# Altium project Telemetry_Pi_Board.PrjPcb
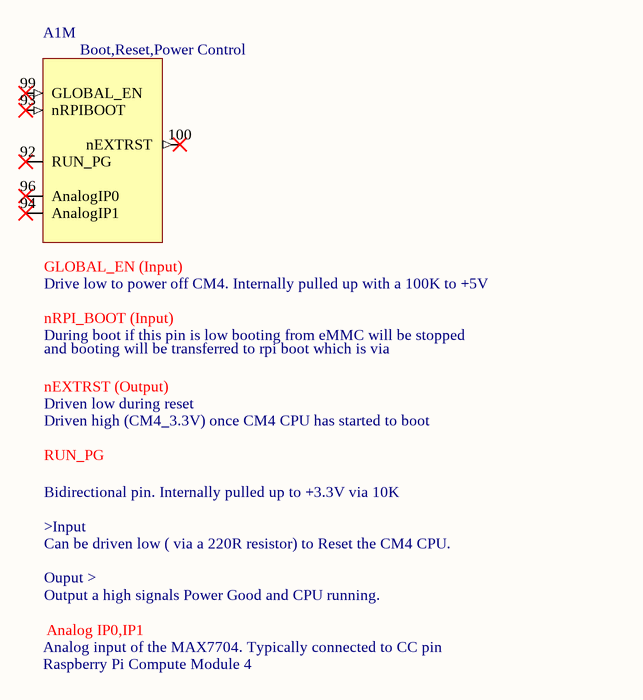
[diagram p0: Pi_Boot_Control.SchDoc]
10 sheets, 106 parts. Net scope: global (net labels, ports and power ports of the same name join across sheets).
Board file: PCB1.PcbDoc
Sheets:
  Pi_Boot_Control.SchDoc
  Telemetry_Pi_Board.SchDoc
  Power.SchDoc
  Pi_Power.SchDoc
  Pi_Cellular.SchDoc
  Ethernet.SchDoc
  Other_Pi.SchDoc
  Other_Pi_2.SchDoc
  GPIO_CAN.SchDoc
  SD_Card.SchDoc

## Sheet Pi_Boot_Control.SchDoc
size A; SheetNumber: 1; SheetTotal: 10

### Parts
A1  Raspberry Pi Compute Module 4  [CM4-F40C-100DS-0.4v_1.5mm_0mm]  (part M of 21)  (no BOM)

### Nets

Not connected (* = marked no-connect by the designer): A1 92(RUN_PG)* 93(nRPIBOOT)* 94(AnalogIP1)* 96(AnalogIP0)* 99(GLOBAL_EN)* 100(nEXTRST)*

### Notes on the sheet
- (in symbol CM4, part M) Boot,Reset,Power Control; GLOBAL_EN (Input); Drive low to power off CM4. Internally pulled up with a 100K to +5V; nRPI_BOOT (Input); During boot if this pin is low booting from eMMC will be stopped; and booting will be transferred to rpi boot which is via; nEXTRST (Output); Driven low during reset; Driven high (CM4_3.3V) once CM4 CPU has started to boot; Bidirectional pin. Internally pulled up to +3.3V via 10K / >Input / Can be driven low ( via a 220R resistor) to Reset the CM4 CPU. / Ouput > / Output a high signals Power Good and CPU running.; Analog IP0,IP1; Analog input of the MAX7704. Typically connected to CC pin

### Library data of the parts
A1 = CM4: Raspberry Pi Compute Module 4 by Amornthep Phunsin; MPN: -

## Sheet Telemetry_Pi_Board.SchDoc
size 279 x 215 mm; SheetNumber: 2; SheetTotal: 10
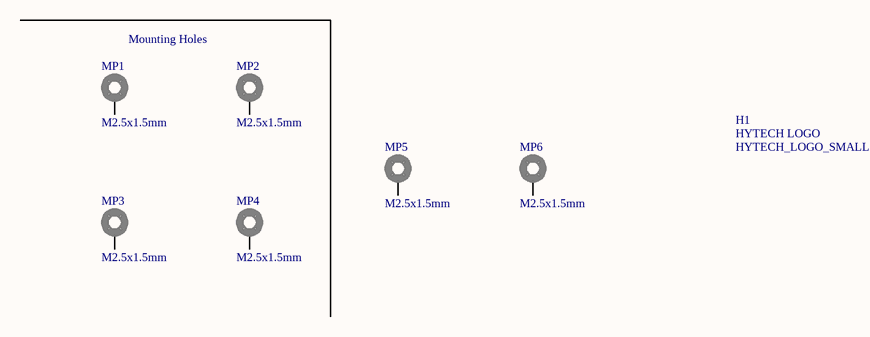
[diagram p1: Telemetry_Pi_Board.SchDoc]

### Parts
H1  HYTECH_LOGO_SMALL  [LOGO-HYTECH-SMALL]
MP1  M2.5x1.5mm  [9774015151]
MP2  M2.5x1.5mm  [9774015151]
MP3  M2.5x1.5mm  [9774015151]
MP4  M2.5x1.5mm  [9774015151]
MP5  M2.5x1.5mm  [9774015151]
MP6  M2.5x1.5mm  [9774015151]

### Nets

Not connected (* = marked no-connect by the designer): MP1 1; MP2 1; MP3 1; MP4 1; MP5 1; MP6 1

### Notes on the sheet
- Mounting Holes
- (in symbol HYTECH_LOGO_SMALL) HYTECH LOGO

### Library data of the parts
MP1-MP6 = 9774015151: WA-SMSI SMT Steel Spacer, M2.5 Thread Internal, OD 5.1mm, M2.5x1.5mm; Manufacturer: Wurth Elektronik; Inner Diameter: 3.5mm; Surface: Tin; ComponentLink1Description: Manufacturer; ComponentLink1URL: http://www.we-online.de; ComponentLink2Description: Datasheet; ComponentLink2URL: https://www.we-online.com/catalog/datasheet/9774015151.pdf; Mounting Technology: SMT; Packaging: Bulk; Length: 1.5mm; Inner Thread Length: -; Operating Temperature: -55 to +150degC; Outer Diameter: 5.1mm; Published Date: April 2020; Material: Steel; Thread: M2.5; MPN: 9774015151; MFR: Wurth Elektronik
H1 = HYTECH_LOGO_SMALL: MPN: -; MFR: -

## Sheet Power.SchDoc
size 279 x 215 mm; SheetNumber: 3; SheetTotal: 10
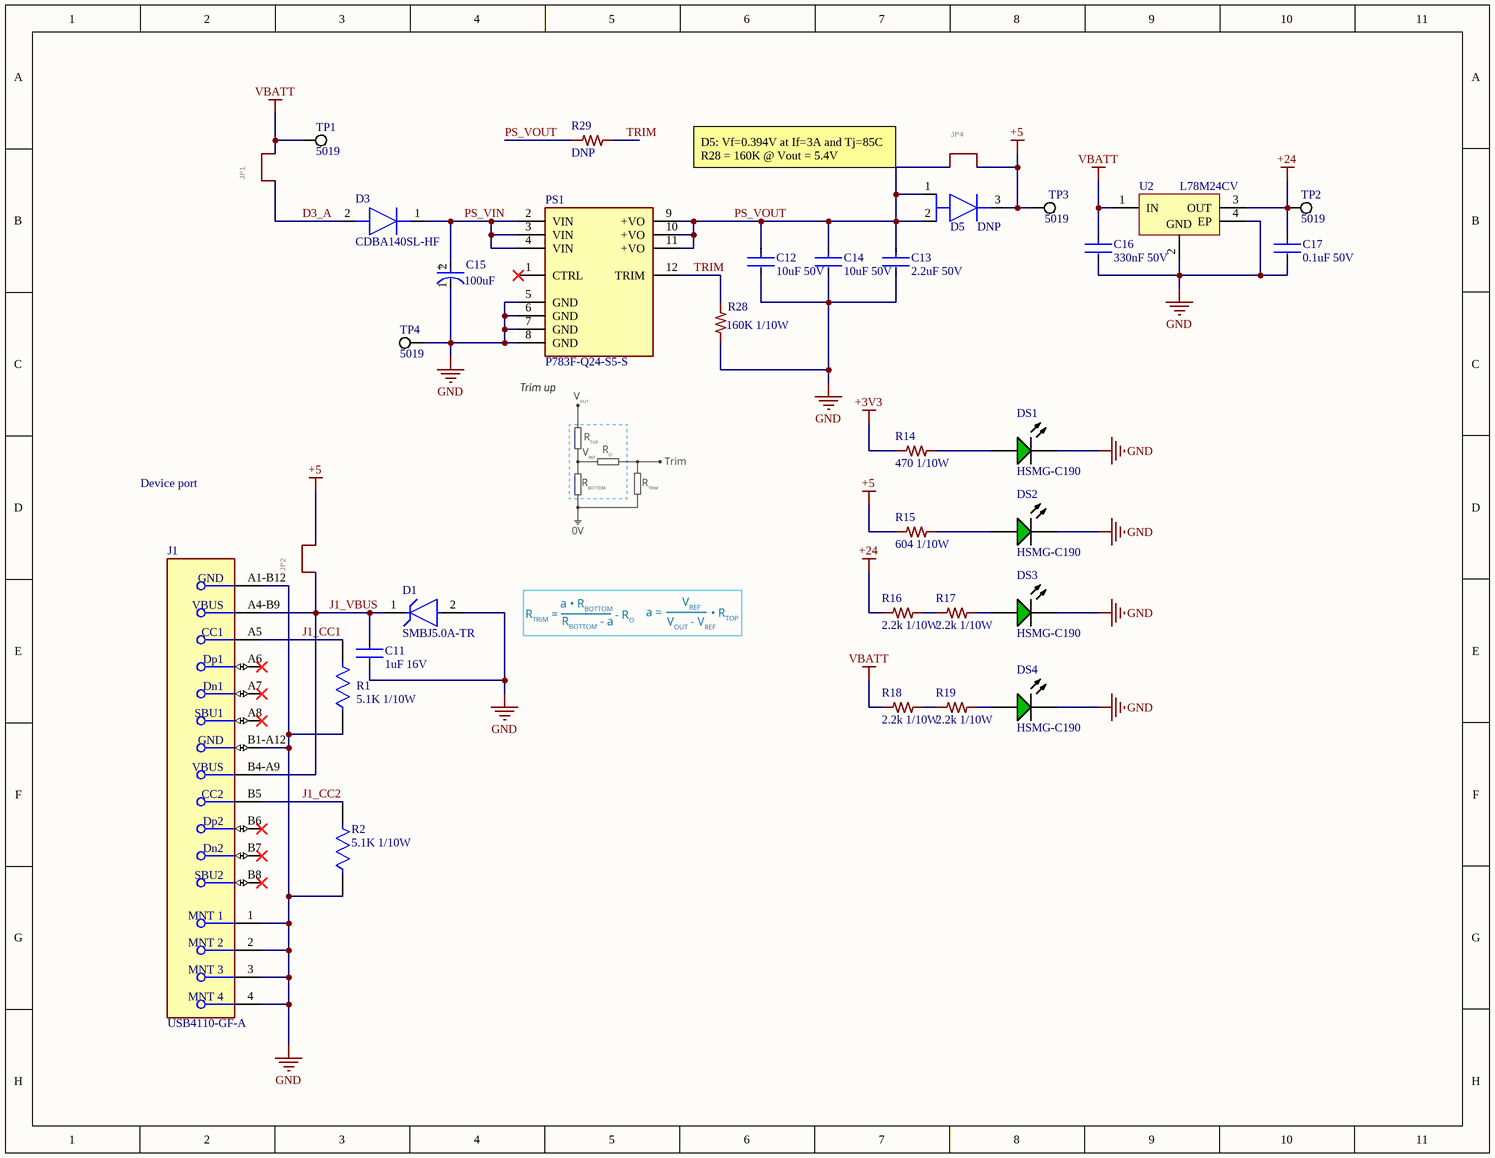
[diagram p2: Power.SchDoc]

### Parts
C11  1uF 16V  [CAPACITOR_0603]
C12  10uF 50V  [FP-GRM21B-0_2-e0_2_0_7-IPC_A]
C13  2.2uF 50V  [CAPACITOR_0603]
C14  10uF 50V  [FP-GRM21B-0_2-e0_2_0_7-IPC_A]
C15  Capacitance: 100uF  [FP-UWT1H101MNL1GS-MFG]  (hidden comment: UWT1H101MNL1GS)
C16  330nF 50V  [CAPACITOR_0603]
C17  0.1uF 50V  [CAPACITOR_0603]
D1  SMBJ5.0A-TR  [FP-SMB-MFG]
D3  CDBA140SL-HF  [DIOM5225X250N]
D5  PMEG045T050EPDZ  [PMEG060V100EPDZ]  (value not drawn)
DS1  HSMG-C190  [AVAG-HSMX-C190_V]
DS2  HSMG-C190  [AVAG-HSMX-C190_V]
DS3  HSMG-C190  [AVAG-HSMX-C190_V]
DS4  HSMG-C190  [AVAG-HSMX-C190_V]
J1  USB4110-GF-A  [FP-USB4110-GF-A-MFG]
JP1  TSM-102-01-L-SV  [FP-TSM-102-01-L-SV-P-TR-MFG]  (value not drawn)
JP2  TSM-102-01-L-SV  [FP-TSM-102-01-L-SV-P-TR-MFG]  (value not drawn)
JP4  CRCW12100000Z0EA  [FP-RMCF1210-IPC_B]  (value not drawn)
PS1  P783F-Q24-S5-S  [CONV_P783F-Q24-S5-S]
R1  5.1K 1/10W  [0603R]
R2  5.1K 1/10W  [0603R]
R14  470 1/10W  [0603R]
R15  604 1/10W  [0603R]
R16  2.2k 1/10W  [0603R]
R17  2.2k 1/10W  [0603R]
R18  2.2k 1/10W  [0603R]
R19  2.2k 1/10W  [0603R]
R28  160K 1/10W  [0603R]
R29  (no value)  [0603R]
TP1  5019  [KSTN-5019_V]
TP2  5019  [KSTN-5019_V]
TP3  5019  [KSTN-5019_V]
TP4  5019  [KSTN-5019_V]
U2  L78M24CV  [TO-220]

### Nets
+3V3: R14.1
+5: D5.3(K) JP2.2 JP4.2 R15.1 TP3.1
+24: C17.2 R16.1 TP2.1 U2.3(OUT)
GND: C11.1 C12.2 C13.2 C14.2 C15.1(C) C16.1 C17.1 D1.2(A) DS1.2(K) DS2.2(K) DS3.2(K) DS4.2(K) J1.1(MNT_1) J1.2(MNT_2) J1.3(MNT_3) J1.4(MNT_4) J1.A1-B12(GND) J1.B1-A12(GND) PS1.5(GND) PS1.6(GND) PS1.7(GND) PS1.8(GND) R1.1 R2.1 R28.1 TP4.1 U2.2(GND) U2.4(EP)
VBATT: C16.2 JP1.2 R18.1 TP1.1 U2.1(IN)
D3_A: D3.2(A) JP1.1
J1_CC1: J1.A5(CC1) R1.2
J1_CC2: J1.B5(CC2) R2.2
J1_VBUS: C11.2 D1.1(K) J1.A4-B9(VBUS) J1.B4-A9(VBUS) JP2.1
PS_VIN: C15.2(A) D3.1(K) PS1.2(VIN) PS1.3(VIN) PS1.4(VIN)
PS_VOUT: C12.1 C13.1 C14.1 D5.1(A) D5.2(A) JP4.1 PS1.9(+VO) PS1.10(+VO) PS1.11(+VO) R29.2
TRIM: PS1.12(TRIM) R28.2 R29.1
NetDS1_1: DS1.1(A) R14.2
NetDS2_1: DS2.1(A) R15.2
NetDS3_1: DS3.1(A) R17.2
NetDS4_1: DS4.1(A) R19.2
NetR16_2: R16.2 R17.1
NetR18_2: R18.2 R19.1

Not connected (* = marked no-connect by the designer): J1 A6(Dp1)* A7(Dn1)* A8(SBU1)* B6(Dp2)* B7(Dn2)* B8(SBU2)*; PS1 1(CTRL)*

### Notes on the sheet
- D5: Vf=0.394V at If=3A and Tj=85C
  R28 = 160K @ Vout = 5.4V
- Device port
- (in symbol CMP-2000-07373-2) +

### Library data of the parts
C11 = CL10A105KO8NNNC: CAP CER 1UF 16V X5R 0603; MFR: Samsung Electro-Mechanics; MPN: CL10A105KO8NNNC
C12 C14 = CMP-06035-004402-1: Chip Multilayer Ceramic Capacitors for General Purpose, 0805, 10uF, X5R, 15%, 10%, 50V; MPN: GRM21BR61H106KE43L; MFR: Murata Electronics; Voltage Rating (DC): 50V; Dielectric: X5R; Tolerance: 10%; Capacitance: 10uF; Thickness: 1.25mm; Length: 2mm; Width: 1.25mm
C13 = GRT188R61H225KE13D: CAP CER 2.2UF 50V X5R 0603; MFR: Murata Electronics; Tolerance: 10%; Case Code (Metric): 1608; Voltage Rating: 50V; Thickness: 0.035inch; Min Operating Temperature: -55°C; Length: 0.063inch; Case/Package: 0603; Mount: Surface Mount; Max Operating Temperature: 85°C; Capacitance: 2.2uF; Dielectric: X5R; Voltage Rating (DC): 50V; Ratings: AEC-Q200; Width: 0.031inch; Case Code (Imperial): 0603; Packaging: Tape and Reel; MPN: GRT188R61H225KE13D
C15 = CMP-2000-07373-2: CAP ALUM 100UF 20% 50V SMD; MFR: Nichicon; Leakage Current: 3uA; Ripple Current: 140mA; Life (Hours): 1000Hour; Dissipation Factor: 0.14%; Dielectric Material: Aluminium; Termination: SMD/SMT; Tolerance: 20%; Package Quantity: 500; Height: 10mm; REACH SVHC: No SVHC; Case/Package: Radial; Series: WT; Diameter: 8mm; Voltage Rating: 50V; Construction: Cylindrical; Length: 10mm; Min Operating Temperature: -55°C; Max Operating Temperature: 105°C; Voltage Rating (DC): 50V; Packaging: Tape and Reel; Voltage: 50V; Mount: Surface Mount; Ripple Current (AC): 140mA; Radiation Hardening: No; Number of Pins: 2; Lead Free: Lead Free; Height - Seated (Max): 0.413inch; RoHS Compliant: Yes; MPN: UWT1H101MNL1GS
C16 = C1608X7R1H334K080AC: CAP CER 0.33UF 50V X7R 0603; MFR: TDK Corporation; Tolerance: 10%; Dielectric Material: Ceramic; Capacitance: 330nF; Case Code (Imperial): 0603; Case Code (Metric): 1608; Dielectric: X7R; Length: 1.6mm; Construction: Flat; Resistor Type: Ceramic; Mount: Surface Mount; Voltage Rating: 50V; Packaging: Tape and Reel; Series: C; Case/Package: 0603; Lead Free: Lead Free; Voltage: 50V; REACH SVHC: No SVHC; Height: 0.8mm; Weight: 7.1E-05oz; Termination: SMD/SMT; Max Operating Temperature: 125°C; RoHS Compliant: Yes; Min Operating Temperature: -55°C; Depth: 0.8mm; Package Quantity: 1; Thickness: 0.037inch; Voltage Rating (DC): 50V; Width: 0.031inch; MPN: C1608X7R1H334K080AC
C17 = CL10B104KB8NNWC: CAP CER 0.1UF 50V X7R 0603; MFR: Samsung Electro-Mechanics; MPN: CL10B104KB8NNWC
D1 = SMBJ5.0A-TR: TVS DIODE 5V 13.4V SMB; MFR: STMicroelectronics; Number Of Channels: 1; Peak Pulse Power: 600W; Clamping Voltage: 14.4V; Standoff Height: 0.05mm; Peak Pulse Current: 275A; Max Junction Temp: +150°C; Direction: Unidirectional; Device Class L3: unset; Mouser Description: SMBJ Series 600 W 5 V Uni Directional SMT TVS Diode - DO-214AA; Lead Free: Yes; ComponentLink2URL: https://www.st.com/resource/en/datasheet/smbj.pdf; Package: SMB; Reverse Standoff Voltage: 5V; Device Class L1: Circuit Protection; RoHS: TRUE; Temperature Range Low: -55°C; Category: Diode; MPN: SMBJ5.0A-TR; Digikey Description: TVS DIODE 5V 13.4V SMB; Height: 2.65mm; Temperature Range High: +150°C; Octopart: https://octopart.com/smbj5.0a-tr-stmicroelectronics-347079; Device Class L2: TVS Diodes; ComponentLink2Description: Datasheet; Temperature: -55°C to +150°C
D3 = CDBA140SL-HF: DIODE SCHOTTKY 40V 1.4A DO214AC; Manufacturer_Name: Comchip Technology; Datasheet Link: http://www.mouser.com/ds/2/80/CDBA140SL-HF RevC729463-766397.pdf; Height: 2.5mm; MPN: CDBA140SL-HF; Mouser Part Number: 750-CDBA140SL-HF; Mouser Price/Stock: https://www.mouser.co.uk/ProductDetail/Comchip-Technology/CDBA140SL-HF?qs=2qJf6qQ4IOIs6CdtgpGzGA%3D%3D; Arrow Part Number: CDBA140SL-HF; MFR: Comchip Technology
D5 = PMEG045T050EPDZ: DIODE SCHOTTKY 45V 5A CFP15; MFR: Nexperia USA Inc.; DNP: DNP; MPN: PMEG045T050EPDZ
DS1-DS4 = HSMG-C190: Chip LED, Green, 2.2 V, -40 to 85 degC, 2-Pin SMD, RoHS, Tape and Reel; MFR: Broadcom Limited; Frequency: 400 KHz; Max Supply Voltage: 5.5 V; Clock Frequency: 100 KHz; Case\Package: SOIC; Density: 32 kb; Nominal Supply Current: 2 mA; Interface: Serial; Min Supply Voltage: 1.7 V; Packaging: Tape and Reel; MPN: HSMG-C190; ComponentLink2URL: http://docs.avagotech.com/docs/AV02-0551EN; RoHSCompliant: true; Pins: 8; REACH SVHC: No SVHC; Max Operating Temperature: 85 degC; Width: 4 mm; Radiation Hardening: No; Package Quantity: 3000; ComponentLink3Description: Package Specification; ComponentLink1Description: Manufacturer URL; Min Operating Temperature: -40 degC; PackageDescription: 2-Pin Surface Mount Device, Body 1.6 x 0.8 mm, Height 0.9 mm; Max Clock Frequency: 100 KHz; Height: 1.5 mm; ComponentLink1URL: http://www.avagotech.com/; DatasheetVersion: Mar-12; ComponentLink2Description: Datasheet; Mount: Surface Mount; Length: 5 mm; ComponentLink3URL: http://www.fairchildsemi.com/dwg/MA/MA03D.pdf
J1 = USB4110-GF-A: CONN USB 2.0 TYPE-C R/A SMT; Manufacturer: GCT; Conn Orientation: Right Angle; Usb Standard: USB 2.0; Voltage Rating: 20V; Current Rating: 3/4.25/1.25/0.25A; Number Of Contacts: 16; Is Female: yes; Shielding: true; Standoff Height: 0.1mm; Octopart: https://octopart.com/usb4110-gf-a-gct-103941985; Temperature: -40°C to +85°C; RoHS: TRUE; Contact Material: Gold,Nickel; Device Class L1: Connectors; Device Class L2: USB Connectors; Package: 0; Lead Free: Yes; ComponentLink2URL: https://gct.co/files/drawings/usb4110.pdf; Temperature Range High: +85°C; Temperature Range Low: -40°C; Height: 3.46mm; ComponentLink2Description: Datasheet; Device Class L3: unset; Digikey Description: CONN USB 2.0 TYPE-C R/A SMT; Category: Conn; MPN: USB4110-GF-A; MFR: GCT
JP1 JP2 = JUMPER_?_SMD_2POS: CONN HEADER SMD 2POS 2.54MM; MANUFACTURER: Samtec Inc.; GateName_1: G$1; SymbolName_1: JUMPER; MPN: TSM-102-01-L-SV; MFR: Samtec Inc.
JP4 = JUMPER_?_1210: RES JUMPER SMD 0 OHM JUMPER 1/2W 1210; MANUFACTURER: Vishay Dale; GateName_1: G$1; SymbolName_1: JUMPER; MPN: CRCW12100000Z0EA; MFR: Vishay Dale
PS1 = P783F-Q24-S5-S: DC DC CONVERTER 5V 15W; MFR: CUI; MPN: P783F-Q24-S5-S; Package: None; Price: None; Value: *
R1 R2 = ERA-3AEB512V: RES SMD 5.1K OHM 0.1% 1/10W 0603; MFR: Panasonic Electronic Components; MFR PN: ERA-3AEB512V; MPN: ERA-3AEB512V
R14 = ERA-3AEB471V: RES SMD 470 OHM 0.1% 1/10W 0603; MANUFACTURER: Panasonic Electronic Components; GateName_1: G$1; SymbolName_1: RESISTOR; DeviceName: 0603; DPKN: *; MPN: ERA-3AEB471V; POWER: *; VOLTAGE_CONTINUOUS: *; VOLTAGE_MAX: *; RESISTANCE: *; MFR: Panasonic Electronic Components
R15 = RMCF0603FT604R: RES SMD 604 OHM 1% 1/10W 0603; MANUFACTURER: Stackpole Electronics Inc; GateName_1: G$1; SymbolName_1: RESISTOR; DeviceName: 0603; DPKN: *; MPN: RMCF0603FT604R; POWER: *; VOLTAGE_CONTINUOUS: *; VOLTAGE_MAX: *; RESISTANCE: *; MFR: Stackpole Electronics Inc
R16-R19 = RT0603BRD072K2L: RES SMD 2.2K OHM 0.1% 1/10W 0603; MANUFACTURER: YAGEO; GateName_1: G$1; SymbolName_1: RESISTOR; DeviceName: 0603; DPKN: *; MPN: RT0603BRD072K2L; POWER: *; VOLTAGE_CONTINUOUS: *; VOLTAGE_MAX: *; RESISTANCE: *; MFR: YAGEO
R28 = RT0603BRD07160KL: RES SMD 160K OHM 0.1% 1/10W 0603; MANUFACTURER: Stackpole Electronics Inc; MPN: RMCF0603FT604R; GateName_1: G$1; SymbolName_1: RESISTOR; DeviceName: 0603; DPKN: *; POWER: *; VOLTAGE_CONTINUOUS: *; VOLTAGE_MAX: *; RESISTANCE: *; MFR: Stackpole Electronics Inc
R29 = RESISTOR_0603: RES SMD CUSTOM 0603; GateName_1: G$1; DeviceName: 0603; SymbolName_1: RESISTOR; DPKN: *; MANUFACTURER: *; MOPN: *; MPN: -; POWER: *; VOLTAGE_CONTINUOUS: *; VOLTAGE_MAX: *; RESISTANCE: *; DNP: DNP
TP1-TP4 = CMP-1672-00008-1: Test Point, 1 Position SMD, RoHS, Tape and Reel; MFR: Keystone Electronics; ComponentLink1Description: Manufacturer URL; Package Quantity: 1000; DatasheetVersion: 03/2014; Packaging: Tape and Reel; ComponentLink2URL: http://www.keyelco.com/product-pdf.cfm?p=1357; ComponentLink1URL: http://www.keyelco.com/; Mount: Surface Mount; Contact Plating: Silver; PackageDescription: 1-Pin Surface Mount Device, Body 3.81 x 2.03 mm; Pins: 1; RoHSCompliant: True; Mounting Technology: Surface Mount; ComponentLink2Description: Datasheet; MPN: 5019
  TP2 TP3: PackageReference: 5019
U2 = L78M24CV: Positive Voltage Regulator, 15V, 3-Pin TO-220; MFR: STMicroelectronics; ComponentLink2URL: http://www.st.com/internet/com/TECHNICAL_RESOURCES/TECHNICAL_LITERATURE/DATASHEET/CD00000447.pdf; ComponentLink3Description: Package Specification; DatasheetVersion: 1/11/2010; ComponentLink2Description: Datasheet; PackageVersion: ver3.0; ComponentLink1URL: http://www.st.com; ComponentLink3URL: http://www.st.com/internet/com/TECHNICAL_RESOURCES/TECHNICAL_LITERATURE/PACKAGE_INFORMATION/CD00004649.pdf; PackageReference: TO220; ComponentLink1Description: Manufacturer URL; PackageDescription: TO, Thru-Hole, Vertical, Heatsink Mounted; 3 In-Line Leads; Pitch 2.54 mm; MPN: L78M24CV

## Sheet Pi_Power.SchDoc
size A; SheetNumber: 4; SheetTotal: 10
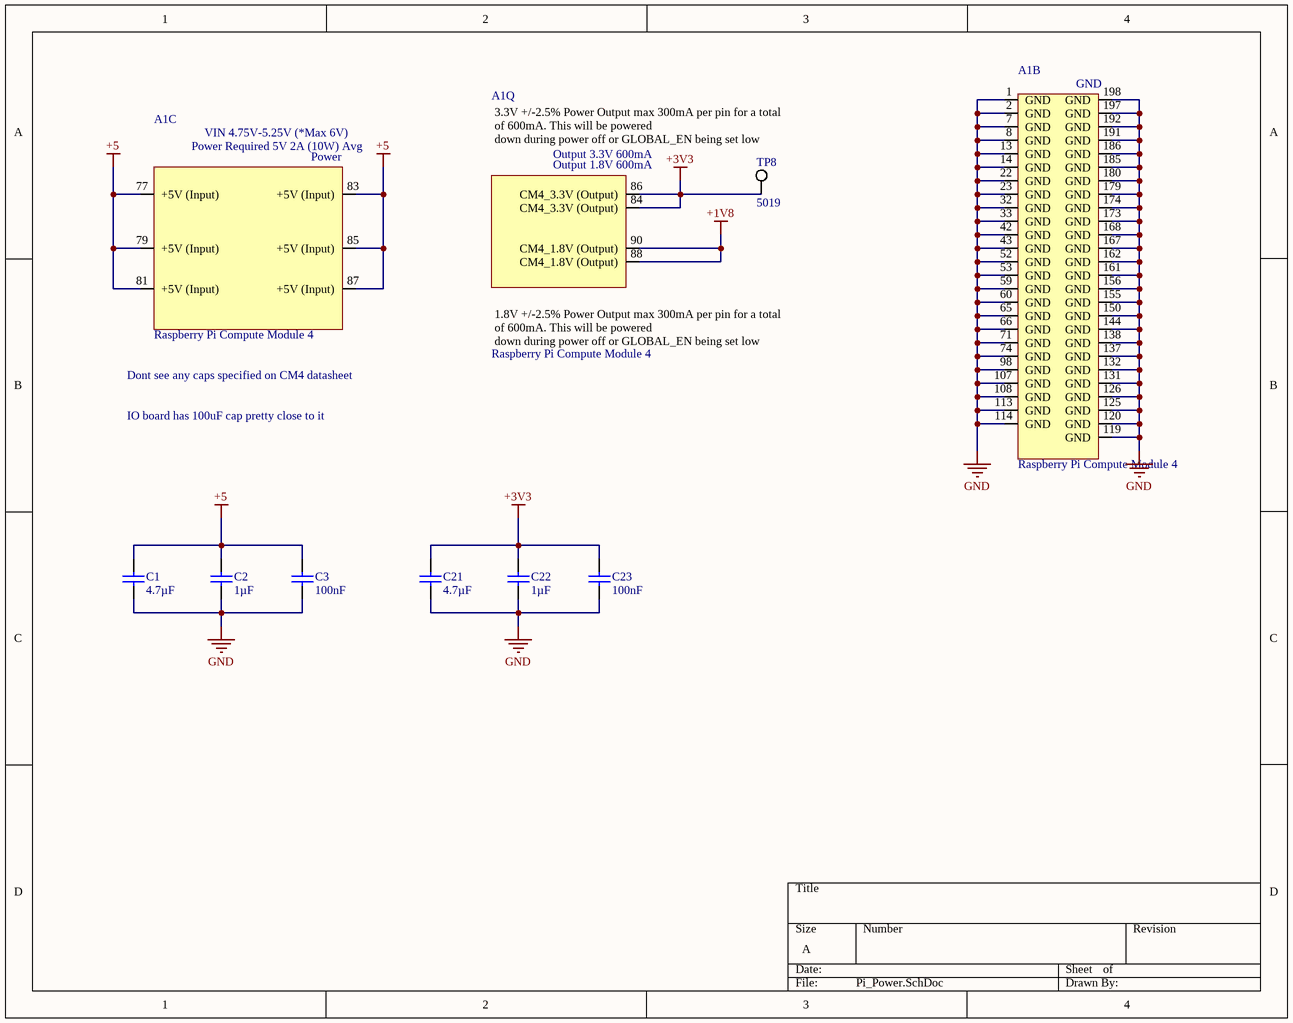
[diagram p3: Pi_Power.SchDoc]

### Parts
A1  Raspberry Pi Compute Module 4  [CM4-F40C-100DS-0.4v_1.5mm_0mm]  (parts B,C,Q of 21)  (no BOM)
C1  value 4.7µF  [CAPC0603(1608)100_L]  (hidden comment: Capacitor 4.7µF +/-20% 10V 0603)
C2  value 1µF  [CAPC1608X94X35NL15T15]  (hidden comment: Capacitor 1 uF +/- 10% 16 V 0603)
C3  value 100nF  [CAPC1005X56X25LL10T15]  (hidden comment: Capacitor 0.1 uF +/- 5% 16 V 0402)
C21  value 4.7µF  [CAPC0603(1608)100_L]  (hidden comment: Capacitor 4.7µF +/-20% 10V 0603)
C22  value 1µF  [CAPC1608X94X35NL15T15]  (hidden comment: Capacitor 1 uF +/- 10% 16 V 0603)
C23  value 100nF  [CAPC1005X56X25LL10T15]  (hidden comment: Capacitor 0.1 uF +/- 5% 16 V 0402)
TP8  5019  [KSTN-5019_V]

### Nets
+1V8: A1.88(CM4_1.8V_(Output)) A1.90(CM4_1.8V_(Output))
+3V3: A1.84(CM4_3.3V_(Output)) A1.86(CM4_3.3V_(Output)) C21.2 C22.2 C23.2 TP8.1
+5: A1.77(+5V_(Input)) A1.79(+5V_(Input)) A1.81(+5V_(Input)) A1.83(+5V_(Input)) A1.85(+5V_(Input)) A1.87(+5V_(Input)) C1.2 C2.2 C3.2
GND: A1.1(GND) A1.2(GND) A1.7(GND) A1.8(GND) A1.13(GND) A1.14(GND) A1.22(GND) A1.23(GND) A1.32(GND) A1.33(GND) A1.42(GND) A1.43(GND) A1.52(GND) A1.53(GND) A1.59(GND) A1.60(GND) A1.65(GND) A1.66(GND) A1.71(GND) A1.74(GND) A1.98(GND) A1.107(GND) A1.108(GND) A1.113(GND) A1.114(GND) A1.119(GND) A1.120(GND) A1.125(GND) A1.126(GND) A1.131(GND) A1.132(GND) A1.137(GND) A1.138(GND) A1.144(GND) A1.150(GND) A1.155(GND) A1.156(GND) A1.161(GND) A1.162(GND) A1.167(GND) A1.168(GND) A1.173(GND) A1.174(GND) A1.179(GND) A1.180(GND) A1.185(GND) A1.186(GND) A1.191(GND) A1.192(GND) A1.197(GND) A1.198(GND) C1.1 C2.1 C3.1 C21.1 C22.1 C23.1

### Notes on the sheet
- Dont see any caps specified on CM4 datasheet
- IO board has 100uF cap pretty close to it
- (in symbol CM4, part C) VIN 4.75V-5.25V (*Max 6V); Power Required 5V 2A (10W) Avg; Power; by Amornthep Phunsin
- (in symbol CM4, part Q) 3.3V +/-2.5% Power Output max 300mA per pin for a total of 600mA. This will be powered / down during power off or GLOBAL_EN being set low; Output 3.3V 600mA; Output 1.8V 600mA; 1.8V +/-2.5% Power Output max 300mA per pin for a total of 600mA. This will be powered / down during power off or GLOBAL_EN being set low

### Library data of the parts
A1 = CM4: as A1 on sheet Pi_Boot_Control; MPN: -
C1 C21 = CMP-001-00076-4: Chip Capacitor, 4.7µF +/-20%, 10V, 0603, Thickness 1 mm; MPN: GRM188Z71A475ME15D; MFR: Murata Electronics; Tolerance: 10%; Mounting Technology: SMT; Case/Package: 0603; Pins: 2; Min Operating Temperature: -55°C; Max Operating Temperature: 85°C; Voltage Rating: 10V
C2 C22 = CMP-001-00003-6: Chip Capacitor, 1 uF, +/- 10%, 16 V, 0603 (1608 Metric); MPN: CL10A105KO8NNNC; MFR: Samsung Electro-Mechanics; Voltage Rating: 16V; Capacitor Type: Ceramic; Max Operating Temperature: 125°C; Pins: 2; Tolerance: 10%; Min Operating Temperature: -55°C; RoHS Compliant: True; Mounting Technology: SM; Case/Package: 0603
C3 C23 = CMP-001-00001-6: Chip Capacitor, 0.1 uF, +/- 5%, 16 V, 0402 (1005 Metric); MFR: Samsung Electro-Mechanics; MPN: CL05B104KP5NNNC; Capacitor Type: Ceramic; Voltage Rating: 16V; Max Operating Temperature: 125°C; Min Operating Temperature: -55°C; Case/Package: 0402; Mounting Technology: SM; Pins: 2; Tolerance: 5%; RoHS Compliant: True
TP8 = CMP-1672-00008-1: as TP1 on sheet Power; ComponentLink1Description: Manufacturer URL; Package Quantity: 1000; DatasheetVersion: 03/2014; Packaging: Tape and Reel; ComponentLink2URL: http://www.keyelco.com/product-pdf.cfm?p=1357; ComponentLink1URL: http://www.keyelco.com/; Mount: Surface Mount; Contact Plating: Silver; PackageDescription: 1-Pin Surface Mount Device, Body 3.81 x 2.03 mm; Pins: 1; RoHSCompliant: True; Mounting Technology: Surface Mount; ComponentLink2Description: Datasheet; PackageReference: 5019; MPN: 5019

## Sheet Pi_Cellular.SchDoc
size A; SheetNumber: 5; SheetTotal: 10
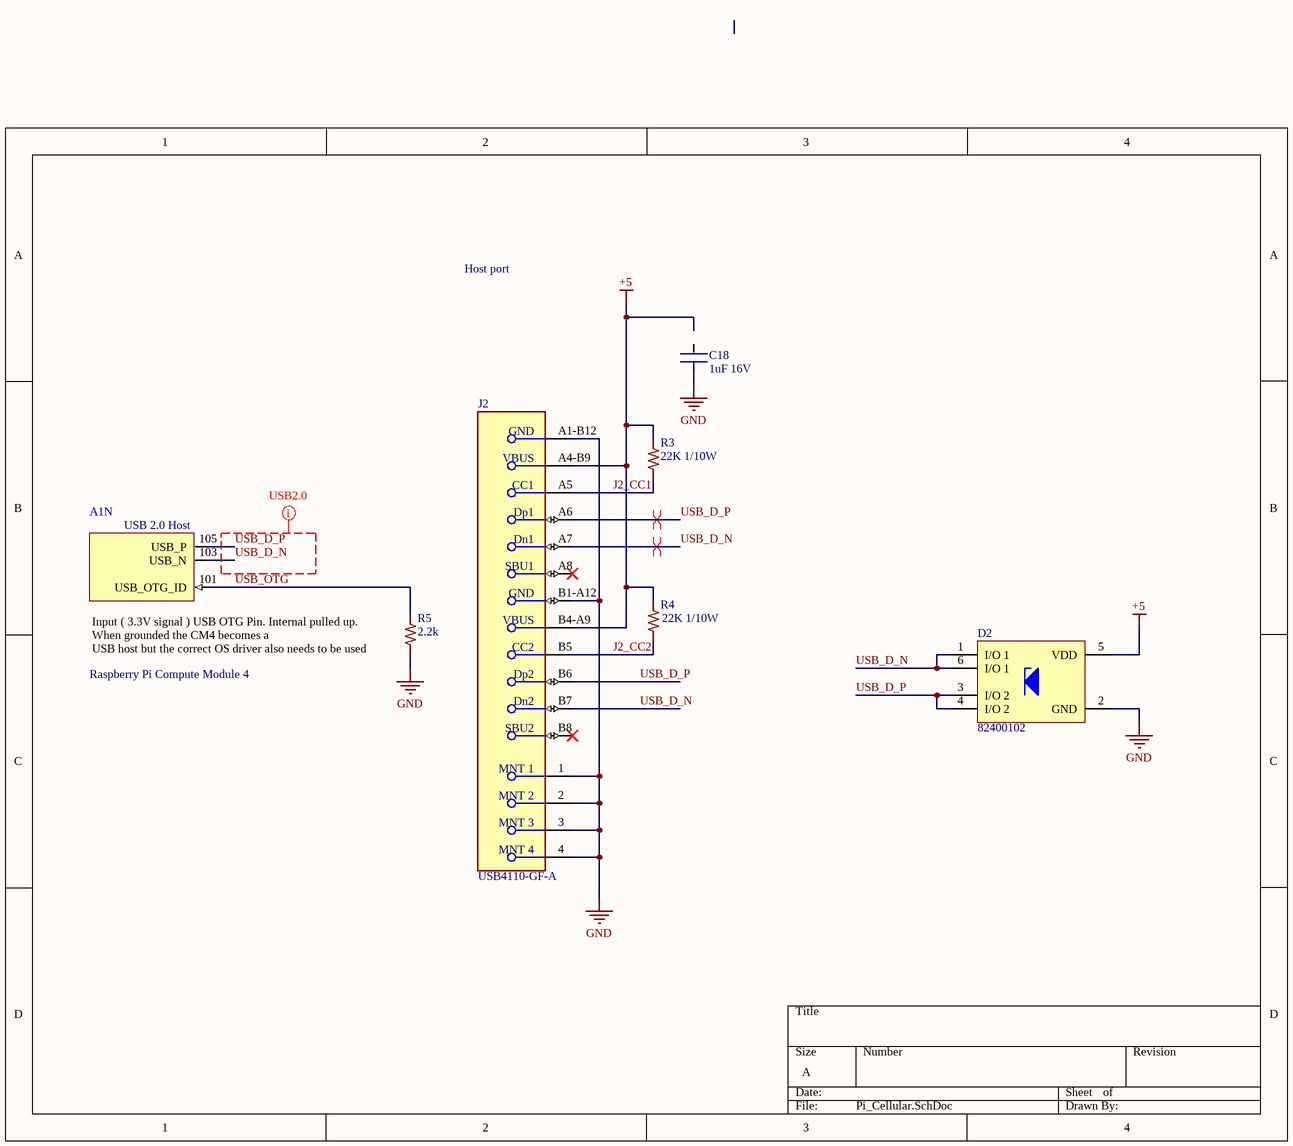
[diagram p4: Pi_Cellular.SchDoc]

### Parts
A1  Raspberry Pi Compute Module 4  [CM4-F40C-100DS-0.4v_1.5mm_0mm]  (part N of 21)  (no BOM)
C18  1uF 16V  [CAPACITOR_0603]
D2  82400102  [WE-TVS_SOT23-6L]
J2  USB4110-GF-A  [FP-USB4110-GF-A-MFG]
R3  22K 1/10W  [0603R]
R4  22K 1/10W  [0603R]
R5  RESISTANCE: 2.2k  [0603R]  (hidden comment: Resistor 0603)

### Nets
+5: D2.5(VDD) J2.A4-B9(VBUS) J2.B4-A9(VBUS) R3.2 R4.2
GND: C18.1 D2.2(GND) J2.1(MNT_1) J2.2(MNT_2) J2.3(MNT_3) J2.4(MNT_4) J2.A1-B12(GND) J2.B1-A12(GND) R5.1
J2_CC1: J2.A5(CC1) R3.1
J2_CC2: J2.B5(CC2) R4.1
USB_D_N: A1.103(USB_N) D2.1(I/O_1) D2.6(I/O_1) J2.A7(Dn1) J2.B7(Dn2)
USB_D_P: A1.105(USB_P) D2.3(I/O_2) D2.4(I/O_2) J2.A6(Dp1) J2.B6(Dp2)
USB_OTG: A1.101(USB_OTG_ID) R5.2

Not connected (* = marked no-connect by the designer): C18 2; J2 A8(SBU1)* B8(SBU2)*

### Layout directives
differential pair: USB_D_N, USB_D_P
net class USB2.0: USB_D_N, USB_D_P

### Notes on the sheet
- Host port
- (in symbol CM4, part N) USB 2.0 Host; Input ( 3.3V signal ) USB OTG Pin. Internal pulled up. When grounded the CM4 becomes a / USB host but the correct OS driver also needs to be used

### Library data of the parts
A1 = CM4: as A1 on sheet Pi_Boot_Control; MPN: -
C18 = CL10A105KO8NNNC: as C11 on sheet Power; MPN: CL10A105KO8NNNC
D2 = CMP-1486-00007-2: TVS DIODE 5VWM 7.7VC SOT23-6L; NexarPartId: 22862942; MFR: Würth Elektronik; Max Reverse Leakage Current: 5A; Test Current: 1mA; Number of Channels: 2; Leakage Current: 5µA; Min Breakdown Voltage: 6V; Working Voltage: 5V; Direction: Unidirectional; Max Surge Current: 6A; Element Configuration: Dual; ESD Protection: Yes; Capacitance: 2pF; Forward Voltage: 800mV; Polarity: Bidirectional; Clamping Voltage: 7.7V; RoHS: Compliant; Number of Bidirectional Channels: 2; Mount: Surface Mount; Number of Pins: 6; Case/Package: SOT-23; Length: 2.9mm; Min Operating Temperature: -55°C; REACH SVHC: Unknown; Max Operating Temperature: 125°C; Max Breakdown Voltage: 6V; Reverse Standoff Voltage: 5V; Width: 2.8mm; Height: 1.16mm; Termination: SMD/SMT; Power Line Protection: Yes; Operating Supply Voltage: 6V; Packaging: Digi-Reel®; Peak Pulse Current: 6A; MPN: 82400102
J2 = USB4110-GF-A: as J1 on sheet Power; Octopart: https://octopart.com/usb4110-gf-a-gct-103941985; Temperature: -40°C to +85°C; RoHS: TRUE; Contact Material: Gold,Nickel; Device Class L1: Connectors; Device Class L2: USB Connectors; Package: 0; Lead Free: Yes; ComponentLink2URL: https://gct.co/files/drawings/usb4110.pdf; Temperature Range High: +85°C; Temperature Range Low: -40°C; Height: 3.46mm; ComponentLink2Description: Datasheet; Device Class L3: unset; Digikey Description: CONN USB 2.0 TYPE-C R/A SMT; Category: Conn; MPN: USB4110-GF-A; MFR: GCT
R3 = RESISTOR_0603: RES SMD 22K OHM 0.1% 1/10W 0603; MPN: ERA-3AEB223V; MFR: Panasonic Electronic Components; GateName_1: G$1; DeviceName: 0603; SymbolName_1: RESISTOR; DPKN: *; MOPN: *; POWER: *; VOLTAGE_CONTINUOUS: *; VOLTAGE_MAX: *; RESISTANCE: 22k
R4 = RESISTOR_0603: RES SMD 22K OHM 0.1% 1/10W 0603; MANUFACTURER: Panasonic Electronic Components; MPN: ERA-3AEB223V; GateName_1: G$1; DeviceName: 0603; SymbolName_1: RESISTOR; DPKN: *; MOPN: *; POWER: *; VOLTAGE_CONTINUOUS: *; VOLTAGE_MAX: *; RESISTANCE: 22k; MFR: Panasonic Electronic Components
R5 = RESISTOR_0603: MANUFACTURER: YAGEO; MPN: RT0603BRD072K2L; GateName_1: G$1; DeviceName: 0603; SymbolName_1: RESISTOR; DPKN: *; MOPN: *; POWER: *; VOLTAGE_CONTINUOUS: *; VOLTAGE_MAX: *; MFR: YAGEO

## Sheet Ethernet.SchDoc
size A; SheetNumber: 6; SheetTotal: 10
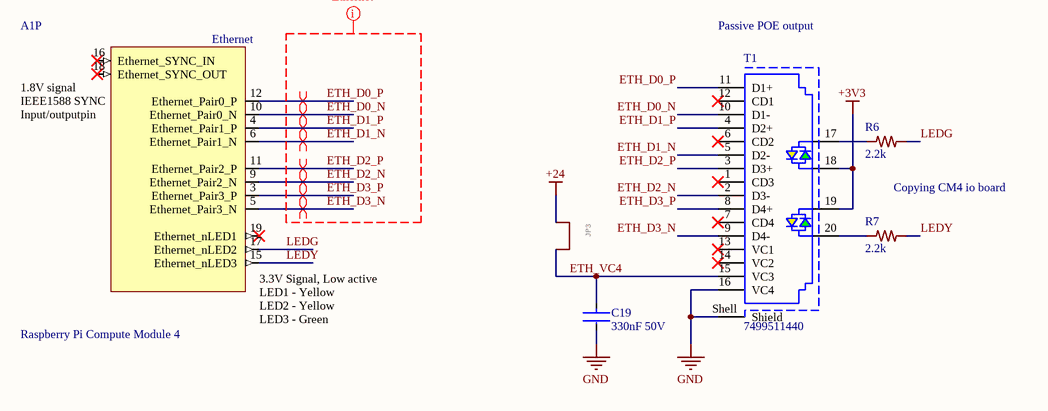
[diagram p5: Ethernet.SchDoc]

### Parts
A1  Raspberry Pi Compute Module 4  [CM4-F40C-100DS-0.4v_1.5mm_0mm]  (part P of 21)  (no BOM)
C19  330nF 50V  [CAPACITOR_0603]
JP3  TSM-102-01-L-SV  [FP-TSM-102-01-L-SV-P-TR-MFG]  (value not drawn)
R6  RESISTANCE: 2.2k  [0603R]  (hidden comment: Resistor 0603)
R7  RESISTANCE: 2.2k  [0603R]  (hidden comment: Resistor 0603)
T1  7499511440  [7499511440]

### Nets
+3V3: T1.18 T1.19
+24: JP3.1
GND: C19.1 T1.16(VC4) T1.Shell(Shield)
ETH_D0_N: A1.10(Ethernet_Pair0_N) T1.10(D1-)
ETH_D0_P: A1.12(Ethernet_Pair0_P) T1.11(D1+)
ETH_D1_N: A1.6(Ethernet_Pair1_N) T1.5(D2-)
ETH_D1_P: A1.4(Ethernet_Pair1_P) T1.4(D2+)
ETH_D2_N: A1.9(Ethernet_Pair2_N) T1.2(D3-)
ETH_D2_P: A1.11(Ethernet_Pair2_P) T1.3(D3+)
ETH_D3_N: A1.5(Ethernet_Pair3_N) T1.9(D4-)
ETH_D3_P: A1.3(Ethernet_Pair3_P) T1.8(D4+)
ETH_VC4: C19.2 JP3.2 T1.15(VC3)
LEDG: A1.17(Ethernet_nLED2) R6.2
LEDY: A1.15(Ethernet_nLED3) R7.2
NetR6_1: R6.1 T1.17
NetR7_1: R7.1 T1.20

Not connected (* = marked no-connect by the designer): A1 16(Ethernet_SYNC_IN)* 18(Ethernet_SYNC_OUT)* 19(Ethernet_nLED1)*; T1 1(CD3)* 6(CD2)* 7(CD4)* 12(CD1)* 13(VC1)* 14(VC2)*

### Layout directives
differential pair: ETH_D0_N, ETH_D0_P, ETH_D1_N, ETH_D1_P, ETH_D2_N, ETH_D2_P, ETH_D3_N, ETH_D3_P
net class Ethernet: ETH_D0_N, ETH_D0_P, ETH_D1_N, ETH_D1_P, ETH_D2_N, ETH_D2_P, ETH_D3_N, ETH_D3_P

### Notes on the sheet
- Passive POE output
- Copying CM4 io board
- (in symbol CM4, part P) Ethernet; 1.8V signal / IEEE1588 SYNC Input/outputpin; by Amornthep Phunsin; 3.3V Signal, Low active / LED1 - Yellow / LED2 - Yellow / LED3 - Green

### Library data of the parts
A1 = CM4: as A1 on sheet Pi_Boot_Control; MPN: -
C19 = C1608X7R1H334K080AC: as C16 on sheet Power; Capacitance: 330nF; Case Code (Imperial): 0603; Case Code (Metric): 1608; Dielectric: X7R; Length: 1.6mm; Construction: Flat; Resistor Type: Ceramic; Mount: Surface Mount; Voltage Rating: 50V; Packaging: Tape and Reel; Series: C; Case/Package: 0603; Lead Free: Lead Free; Voltage: 50V; REACH SVHC: No SVHC; Height: 0.8mm; Weight: 7.1E-05oz; Termination: SMD/SMT; Max Operating Temperature: 125°C; RoHS Compliant: Yes; Min Operating Temperature: -55°C; Depth: 0.8mm; Package Quantity: 1; Thickness: 0.037inch; Voltage Rating (DC): 50V; Width: 0.031inch; MPN: C1608X7R1H334K080AC
JP3 = JUMPER_?_SMD_2POS: as JP1 on sheet Power; MPN: TSM-102-01-L-SV; MFR: Samtec Inc.
R6 R7 = RESISTOR_0603: MPN: RT0603BRD072K2L; MFR: YAGEO; GateName_1: G$1; DeviceName: 0603; SymbolName_1: RESISTOR; DPKN: *; MANUFACTURER: *; MOPN: *; POWER: *; VOLTAGE_CONTINUOUS: *; VOLTAGE_MAX: *
T1 = CMP-03913-30832512-2: Telecom and Datacom Connector; Manufacturer: Wurth Electronics; Color: Green, Yellow; Pitch: 2.54mm; Insertion Loss (dB): -1.2dB; Gender: Female; Shielding: Shielded; Number of Positions: 8; Inductance: 350µH; Connector Type: RJ45; Direction: Up; Number of Ports: 1; REACH SVHC: Unknown; Min Operating Temperature: -40°C; Mount: Through Hole; NexarPartId: 30832512; Housing Material: Thermoplastic; Termination: Through Hole; Number of Rows: 1; Lead Free: Lead Free; RoHS: Compliant; Flammability Rating: UL94 V-0; Width: 17mm; Height: 13.87mm; Number of Cores per Jack: 8; Max Operating Temperature: 85°C; Contact Plating: Gold; Number of Contacts: 8; Contact Material: Ferrite, Gold, Tin; Length: 33.02mm; Supplier: Digi-Key; Supplier Part Number: 732-4965-ND; Category: Modular / Ethernet Connectors; Stock: 1682; Pricing: 1=14.96, 10=14.709, 50=13.659, 100=12.608, 500=11.55804 (USD); Contact Finish - Mating: GOLD (30); Contact Finish - Termination: TIN OVER NICKEL; JESD-609 Code: e3; Reach SVHC Compliant: No; RoHS Compliant: Yes; ComponentLink1URL: https://datasheet.ciiva.com:443/pdfs/VipMasterIC/IC/MIDC/MIDC-S-A0004025553/MIDC-S-A0004711821-1.pdf?src-supplier=IHS+Markit; ComponentLink1Description: https://datasheet.ciiva.com:443/pdfs/VipMasterIC/IC/MIDC/MIDC-S-A0004025553/MIDC-S-A0004711821-1.pdf?src-supplier=IHS+Markit; ComponentLink2URL: https://datasheet.ciiva.com/24091/7499511440-254189-24091260.pdf?src-supplier=Mouser; ComponentLink2Description: https://datasheet.ciiva.com/24091/7499511440-254189-24091260.pdf?src-supplier=Mouser; ComponentLink3URL: https://datasheet.ciiva.com/22749/1737251-22749408.pdf?src-supplier=Element14; ComponentLink3Description: https://datasheet.ciiva.com/22749/1737251-22749408.pdf?src-supplier=Element14; ComponentLink4URL: https://datasheet.ciiva.com/29167/7499511440-29167180.pdf?src-supplier=Digi-Key; ComponentLink4Description: https://datasheet.ciiva.com/29167/7499511440-29167180.pdf?src-supplier=Digi-Key; MPN: 7499511440; MFR: Wurth Electronics

## Sheet Other_Pi.SchDoc
size A; SheetNumber: 7; SheetTotal: 10
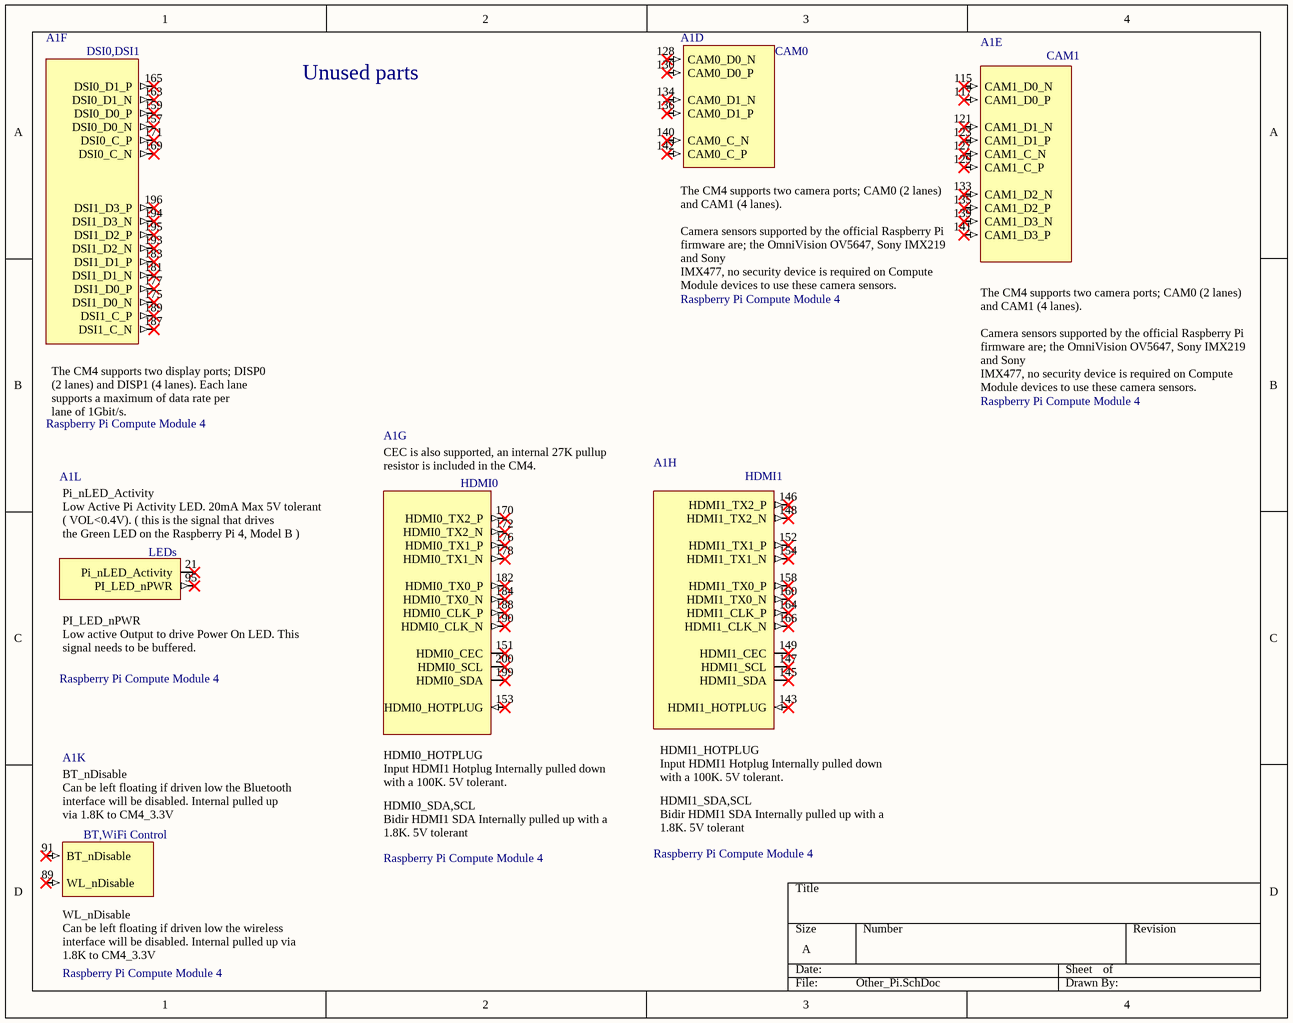
[diagram p6: Other_Pi.SchDoc]

### Parts
A1  Raspberry Pi Compute Module 4  [CM4-F40C-100DS-0.4v_1.5mm_0mm]  (parts D,E,F,G,H,K,L of 21)  (no BOM)

### Nets

Not connected (* = marked no-connect by the designer): A1 21(Pi_nLED_Activity)* 89(WL_nDisable)* 91(BT_nDisable)* 95(PI_LED_nPWR)* 115(CAM1_D0_N)* 117(CAM1_D0_P)* 121(CAM1_D1_N)* 123(CAM1_D1_P)* 127(CAM1_C_N)* 128(CAM0_D0_N)* 129(CAM1_C_P)* 130(CAM0_D0_P)* 133(CAM1_D2_N)* 134(CAM0_D1_N)* 135(CAM1_D2_P)* 136(CAM0_D1_P)* 139(CAM1_D3_N)* 140(CAM0_C_N)* 141(CAM1_D3_P)* 142(CAM0_C_P)* 143(HDMI1_HOTPLUG)* 145(HDMI1_SDA)* 146(HDMI1_TX2_P)* 147(HDMI1_SCL)* 148(HDMI1_TX2_N)* 149(HDMI1_CEC)* 151(HDMI0_CEC)* 152(HDMI1_TX1_P)* 153(HDMI0_HOTPLUG)* 154(HDMI1_TX1_N)* 157(DSI0_D0_N)* 158(HDMI1_TX0_P)* 159(DSI0_D0_P)* 160(HDMI1_TX0_N)* 163(DSI0_D1_N)* 164(HDMI1_CLK_P)* 165(DSI0_D1_P)* 166(HDMI1_CLK_N)* 169(DSI0_C_N)* 170(HDMI0_TX2_P)* 171(DSI0_C_P)* 172(HDMI0_TX2_N)* 175(DSI1_D0_N)* 176(HDMI0_TX1_P)* 177(DSI1_D0_P)* 178(HDMI0_TX1_N)* 181(DSI1_D1_N)* 182(HDMI0_TX0_P)* 183(DSI1_D1_P)* 184(HDMI0_TX0_N)* 187(DSI1_C_N)* 188(HDMI0_CLK_P)* 189(DSI1_C_P)* 190(HDMI0_CLK_N)* 193(DSI1_D2_N)* 194(DSI1_D3_N)* 195(DSI1_D2_P)* 196(DSI1_D3_P)* 199(HDMI0_SDA)* 200(HDMI0_SCL)*

### Notes on the sheet
- Unused parts
- (in symbol CM4, part D) CAM0; The CM4 supports two camera ports; CAM0 (2 lanes) and CAM1 (4 lanes). / Camera sensors supported by the official Raspberry Pi firmware are; the OmniVision OV5647, Sony IMX219 and Sony / IMX477, no security device is required on Compute Module devices to use these camera sensors.
- (in symbol CM4, part E) CAM1; The CM4 supports two camera ports; CAM0 (2 lanes) and CAM1 (4 lanes). / Camera sensors supported by the official Raspberry Pi firmware are; the OmniVision OV5647, Sony IMX219 and Sony / IMX477, no security device is required on Compute Module devices to use these camera sensors.
- (in symbol CM4, part F) DSI0,DSI1; The CM4 supports two display ports; DISP0 (2 lanes) and DISP1 (4 lanes). Each lane supports a maximum of data rate per / lane of 1Gbit/s.
- (in symbol CM4, part G) HDMI0; CEC is also supported, an internal 27K pullup resistor is included in the CM4.; HDMI0_HOTPLUG / Input HDMI1 Hotplug Internally pulled down with a 100K. 5V tolerant.; HDMI0_SDA,SCL / Bidir HDMI1 SDA Internally pulled up with a 1.8K. 5V tolerant
- (in symbol CM4, part H) HDMI1; HDMI1_HOTPLUG / Input HDMI1 Hotplug Internally pulled down with a 100K. 5V tolerant.; HDMI1_SDA,SCL / Bidir HDMI1 SDA Internally pulled up with a 1.8K. 5V tolerant
- (in symbol CM4, part K) BT_nDisable / Can be left floating if driven low the Bluetooth interface will be disabled. Internal pulled up / via 1.8K to CM4_3.3V; BT,WiFi Control; WL_nDisable / Can be left floating if driven low the wireless interface will be disabled. Internal pulled up via / 1.8K to CM4_3.3V
- (in symbol CM4, part L) Pi_nLED_Activity / Low Active Pi Activity LED. 20mA Max 5V tolerant ( VOL<0.4V). ( this is the signal that drives / the Green LED on the Raspberry Pi 4, Model B ); LEDs; PI_LED_nPWR / Low active Output to drive Power On LED. This signal needs to be buffered.

### Library data of the parts
A1 = CM4: as A1 on sheet Pi_Boot_Control; MPN: -

## Sheet Other_Pi_2.SchDoc
size A; SheetNumber: 8; SheetTotal: 10
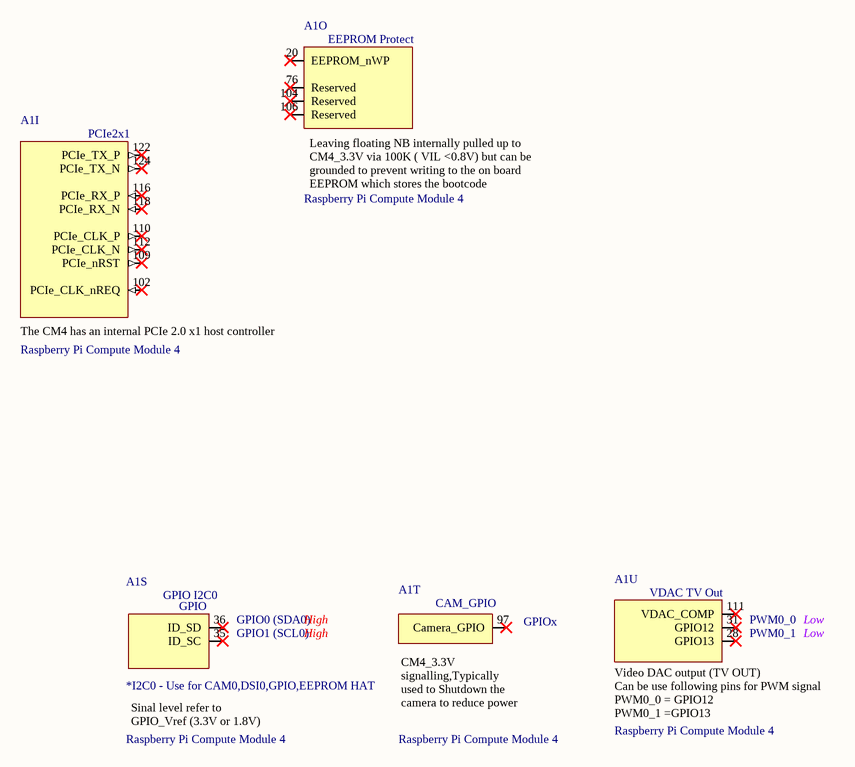
[diagram p7: Other_Pi_2.SchDoc]

### Parts
A1  Raspberry Pi Compute Module 4  [CM4-F40C-100DS-0.4v_1.5mm_0mm]  (parts I,O,S,T,U of 21)  (no BOM)

### Nets

Not connected (* = marked no-connect by the designer): A1 20(EEPROM_nWP)* 28(GPIO13)* 31(GPIO12)* 35(ID_SC)* 36(ID_SD)* 76(Reserved)* 97(Camera_GPIO)* 102(PCIe_CLK_nREQ)* 104(Reserved)* 106(Reserved)* 109(PCIe_nRST)* 110(PCIe_CLK_P)* 111(VDAC_COMP)* 112(PCIe_CLK_N)* 116(PCIe_RX_P)* 118(PCIe_RX_N)* 122(PCIe_TX_P)* 124(PCIe_TX_N)*

### Notes on the sheet
- (in symbol CM4, part I) PCIe2x1; The CM4 has an internal PCIe 2.0 x1 host controller
- (in symbol CM4, part O) EEPROM Protect; Leaving floating NB internally pulled up to CM4_3.3V via 100K ( VIL <0.8V) but can be / grounded to prevent writing to the on board EEPROM which stores the bootcode
- (in symbol CM4, part S) GPIO I2C0; GPIO; GPIO0 (SDA0); High; GPIO1 (SCL0); *I2C0 - Use for CAM0,DSI0,GPIO,EEPROM HAT; Sinal level refer to  GPIO_Vref (3.3V or 1.8V)
- (in symbol CM4, part T) CAM_GPIO; GPIOx; CM4_3.3V signalling,Typically used to Shutdown the camera to reduce power
- (in symbol CM4, part U) VDAC TV Out; PWM0_0; Low; PWM0_1; Video DAC output (TV OUT) / Can be use following pins for PWM signal / PWM0_0 = GPIO12 / PWM0_1 =GPIO13

### Library data of the parts
A1 = CM4: as A1 on sheet Pi_Boot_Control; MPN: -

## Sheet GPIO_CAN.SchDoc
size A; SheetNumber: 9; SheetTotal: 10
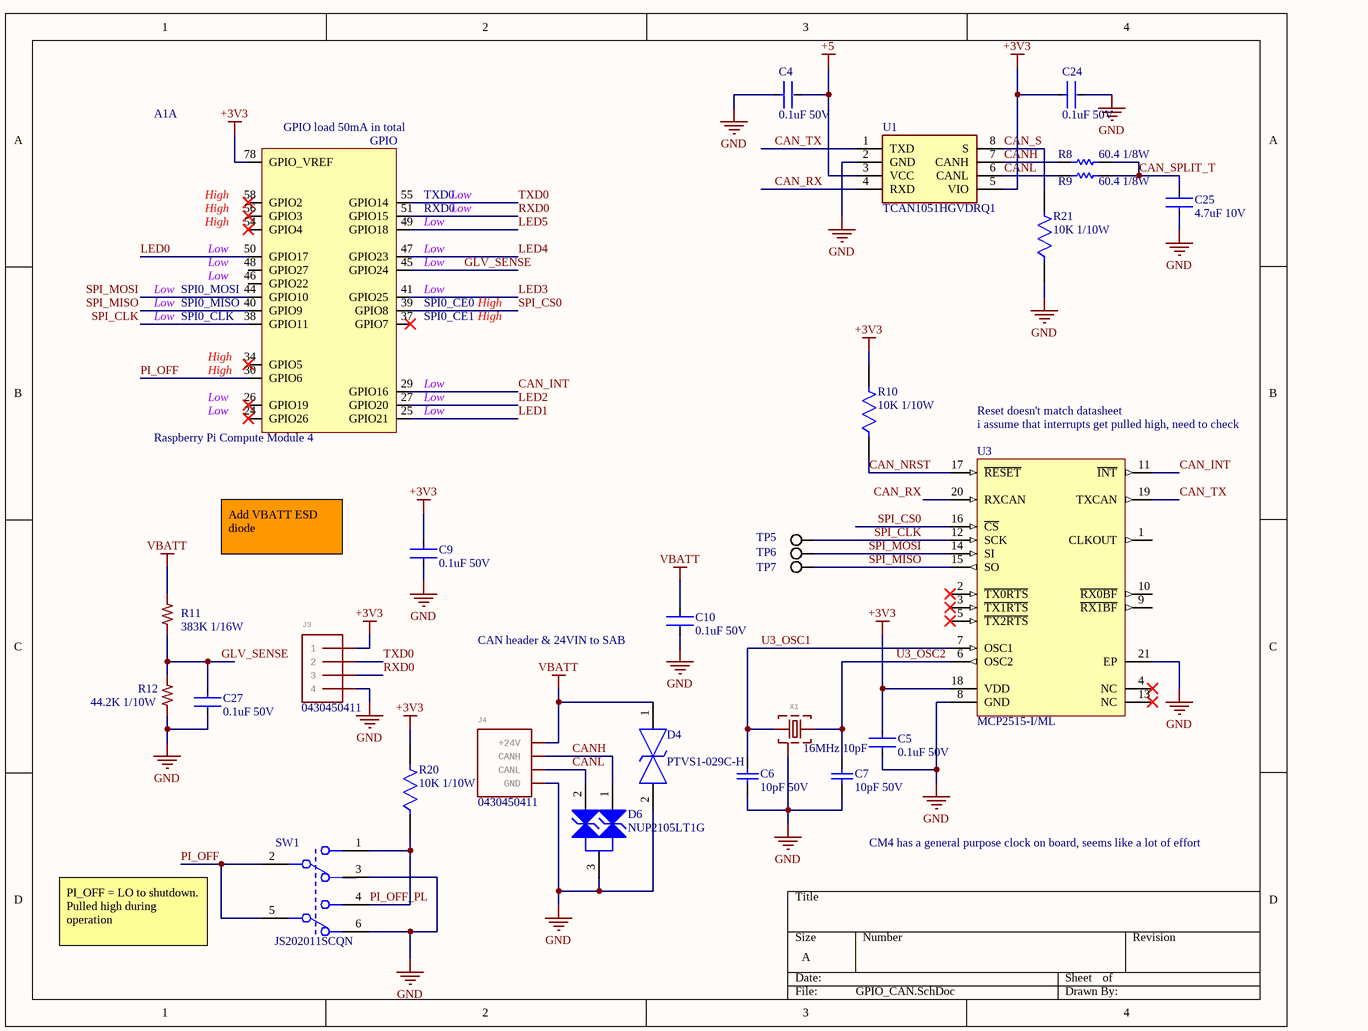
[diagram p8: GPIO_CAN.SchDoc]

### Parts
A1  Raspberry Pi Compute Module 4  [CM4-F40C-100DS-0.4v_1.5mm_0mm]  (part A of 21)  (no BOM)
C4  0.1uF 50V  [CAPACITOR_0603]
C5  0.1uF 50V  [CAPACITOR_0603]
C6  10pF 50V  [CAPC1608X90X40ML10T20]
C7  10pF 50V  [CAPC1608X90X40ML10T20]
C9  0.1uF 50V  [CAPACITOR_0603]
C10  0.1uF 50V  [CAPACITOR_0603]
C24  0.1uF 50V  [CAPACITOR_0603]
C25  4.7uF 10V  [CAPACITOR_0603]
C27  0.1uF 50V  [CAPACITOR_0603]
D4  PTVS1-029C-H  [PTVS1029CH]
D6  NUP2105LT1G  [ONSC-SOT-23-3-318-08_V]
J3  MPN: 0430450411  [43045-04YY_09101192]  (hidden comment: 4 Pin Connector)
J4  MPN: 0430450411  [43045-04YY_09101192]  (hidden comment: HyTech CAN Connector)
R8  60.4 1/8W  [RESC1608X55X30ML20T10]
R9  60.4 1/8W  [RESC1608X55X30ML20T10]
R10  10K 1/10W  [0603R]
R11  383K 1/16W  [0402R]
R12  44.2K 1/10W  [0402R]
R20  10K 1/10W  [0603R]
R21  10K 1/10W  [0603R]
SW1  JS202011SCQN  [FP-JS202011SCQN-MFG]
TP5  5019  [KSTN-5019_V]  (value not drawn)
TP6  5019  [KSTN-5019_V]  (value not drawn)
TP7  5019  [KSTN-5019_V]  (value not drawn)
U1  TCAN1051HGVDRQ1  [SOIC127P600X175-8N]
U3  MCP2515-I/ML  [QFN-ML20_L]
X1  16MHz 10pF  [XTAL_ECS-160-10-42-CKM-TR]

### Nets
+3V3: A1.78(GPIO_VREF) C5.2 C9.2 C24.2 J3.1 R10.2 R20.2 U1.5(VIO) U3.18(VDD)
+5: C4.1 U1.3(VCC)
GND: C4.2 C5.1 C6.1 C7.1 C9.1 C10.1 C24.1 C25.1 C27.1 D4.2 D6.3(K) J3.4 J4.2(GND) R12.1 R21.1 SW1.3 SW1.6 U1.2(GND) U3.8(GND) U3.21(EP) X1.2,4(GND)
VBATT: C10.2 D4.1 J4.1(+24V) R11.2
CAN_INT: A1.29(GPIO16) U3.11(~{INT})
CAN_NRST: R10.1 U3.17(~{RESET})
CAN_RX: U1.4(RXD) U3.20(RXCAN)
CAN_S: R21.2 U1.8(S)
CAN_SPLIT_T: C25.2 R8.2 R9.2
CAN_TX: U1.1(TXD) U3.19(TXCAN)
CANH: D6.1(K) J4.4(CANH) R8.1 U1.7(CANH)
CANL: D6.2(K) J4.3(CANL) R9.1 U1.6(CANL)
GLV_SENSE: A1.45(GPIO24) C27.2 R11.1 R12.2
LED0: A1.50(GPIO17)
LED1: A1.25(GPIO21)
LED2: A1.27(GPIO20)
LED3: A1.41(GPIO25)
LED4: A1.47(GPIO23)
LED5: A1.49(GPIO18)
PI_OFF: A1.30(GPIO6) SW1.2 SW1.5
PI_OFF_PL: R20.1 SW1.1 SW1.4
RXD0: A1.51(GPIO15) J3.3
SPI_CLK: A1.38(GPIO11) TP5.1 U3.12(SCK)
SPI_CS0: A1.39(GPIO8) U3.16(~{CS})
SPI_MISO: A1.40(GPIO9) TP7.1 U3.15(SO)
SPI_MOSI: A1.44(GPIO10) TP6.1 U3.14(SI)
TXD0: A1.55(GPIO14) J3.2
U3_OSC1: C6.2 U3.7(OSC1) X1.1
U3_OSC2: C7.2 U3.6(OSC2) X1.3

Not connected (* = marked no-connect by the designer): A1 24(GPIO26)* 26(GPIO19)* 34(GPIO5)* 37(GPIO7)* 46(GPIO22) 48(GPIO27) 54(GPIO4)* 56(GPIO3)* 58(GPIO2)*; U3 1(CLKOUT) 2(~{TX0RTS})* 3(~{TX1RTS})* 4(NC)* 5(~{TX2RTS})* 9(~{RX1BF}) 10(~{RX0BF}) 13(NC)*

### Notes on the sheet
- Reset doesn't match datasheet
- (near U3) i assume that interrupts get pulled high, need to check
- Add VBATT ESD diode
- (near C10) CAN header & 24VIN to SAB
- CM4 has a general purpose clock on board, seems like a lot of effort
- PI_OFF = LO to shutdown. Pulled high during operation
- (in symbol CM4, part A) GPIO load 50mA in total; GPIO; High; TXD0; Low; RXD0; SPI0_MOSI; SPI0_MISO; SPI0_CE0; SPI0_CLK; SPI0_CE1; by Amornthep Phunsin

### Library data of the parts
A1 = CM4: Raspberry Pi Compute Module 4 by Amornthep Phunsin; MPN: SC0695; MFR: Raspberry Pi
C4 C5 C9 C10 C24 C27 = CL10B104KB8NNWC: as C17 on sheet Power; MPN: CL10B104KB8NNWC
C6 C7 = CMP-2100-03593-1: Chip Capacitor, 10 pF, +/- 5%, 50 V, -55 to 125 degC, 0603 (1608 Metric), RoHS, Tape and Reel; Manufacturer: Yageo; MPN: CC0603JRNPO9BN100; Insulation Resistance: 100GR; Temperature Coefficient: 30ppm/degC; Dielectric: C0G; Radiation Hardening: No; Mount: SurfaceMount; Width: 0.031inch; Composition: Ceramic; Package Description: 2-Pin Surface Mount Device, Body 1.6 x 0.8 mm; Min Operating Temperature: -55degC; Case Code (Metric): 1608; Datasheet URL: http://www.yageo.com/documents/recent/UPY-GP_NP0_16V-to-50V_14.pdf; Voltage Rating: 50V; Termination: SMD/SMT; REACH SVHC: NoSVHC; Case/Package: 0603; RoHSCompliant: True; Packaging: TapeandReel; Max Operating Temperature: 125degC; Voltage: 50V; Package Quantity: 1; Manufacturer URL: http://www.yageo.com/; Tolerance: 5%; Capacitance: 10pF; Height: 0.8mm; Depth: 0.8mm; Thickness: 0.035inch; Case Code (Imperial): 0603; Length: 1.6mm; Package Reference: 0603; Voltage Rating (DC): 50V; Lead Free: LeadFree; Number of Pins: 2; Datasheet Version: Rev. 14, 07/2016; MFR: YAGEO
C25 = CL10A475KP8NNNC: CAP CER 4.7UF 10V X5R 0603; MFR: Samsung Electro-Mechanics; MPN: CL10A475KP8NNNC
D4 = PTVS1-029C-H: TVS Diode (Bi-directional); Manufacturer_Name: Bourns; Datasheet Link: https://g.componentsearchengine.com/Datasheets/0/16509875.pdf; Height: 2.6mm; Mouser Part Number: 652-PTVS1-029C-H; Mouser Price/Stock: https://www.mouser.co.uk/ProductDetail/Bourns/PTVS1-029C-H?qs=vvQtp7zwQdNgKzZ3txsBHg%3D%3D; Arrow Part Number: PTVS1-029C-H; MPN: PTVS1-029C-H; MFR: Bourns
D6 = NUP2105LT1G: Dual Line CAN Bus Protector, 3-Pin SOT-23, Pb-Free, Tape and Reel; MFR: On Semiconductor; IR Max (uA): 0.1; Number of Lines: 2; Direction: Bidirectional; PPK Max (W): 350; V(BR) Min (V): 26.2; ComponentLink3URL: http://www.onsemi.cn/pub_link/Collateral/318-08.PDF; Mounting Technology: Surface Mount; ComponentLink2Description: Datasheet; MPN: NUP2105LT1G; ComponentLink1URL: http://www.onsemi.com/; PackageVersion: Rev. AP, 11/2009; DatasheetVersion: Rev. 5; RoHS: Pb-Free; PackageReference: SOT-23-3-318-08; ComponentLink2URL: http://www.onsemi.cn/pub_link/Collateral/NUP2105L-D.PDF; ComponentLink1Description: Manufacturer URL; PackageDescription: 3-Pin Small Outline Transistor, Body 2.92 x 1.3 mm, Pitch 0.95 mm; Packing: Tape and Reel; ComponentLink3Description: Package Specification
J3 = CONNECTOR-4_?_*μF_S_RA: CONN HEADER SMD R/A 4POS 3MM; MANUFACTURER: Molex; GateName_1: G$1; SymbolName_1: CONNECTOR_04; DKPN: WM1832CT-ND; MOPN: 538-0430450411; DeviceName: μF_S_RA; LibraryName: HyTechDevices; DeviceSetName: CONNECTOR-4_?_*; Package: MOLEX_MICROFIT_SMD_RIGHTANGLE_04_DUAL; MFR: Molex
J4 = CONNECTOR-CAN_?_*μF_S_RA: CONN HEADER SMD R/A 4POS 3MM; MANUFACTURER: Molex; GateName_1: G$1; SymbolName_1: CONNECTOR_CAN; DKPN: WM1832CT-ND; MOPN: 538-43045-0411; DeviceName: μF_S_RA; LibraryName: HyTechDevices; DeviceSetName: CONNECTOR-CAN_?_*; Package: MOLEX_MICROFIT_SMD_RIGHTANGLE_04_DUAL; MFR: Molex
R8 R9 = CMP-2000-01611-1: RES SMD 60.4 OHM 1% 1/8W 0603; Manufacturer: KOA Speer; MPN: RK73H1JTTD60R4F; MFR: KOA Speer
R10 R20 R21 = ERJ-3EKF1002V: RES SMD 10K OHM 1% 1/10W 0603; MFR: Parasonic; MFR PN: ERJ-3EKF1002V; MPN: ERJ-3EKF1002V
R11 = RC0402FR-07383KL: RES SMD 383K OHM 1% 1/16W 0402; MANUFACTURER: YAGEO; GateName_1: G$1; SymbolName_1: RESISTOR; DeviceName: 0402; POWER: *; DPKN: *; MPN: RC0402FR-07383KL; VOLTAGE_CONTINUOUS: *; VOLTAGE_MAX: *; RESISTANCE: *; MFR: YAGEO
R12 = ERJ-2RKF4422X: RES SMD 44.2K OHM 1% 1/10W 0402; MANUFACTURER: Panasonic Electronic Components; GateName_1: G$1; SymbolName_1: RESISTOR; DeviceName: 0402; DPKN: *; MPN: ERJ-2RKF4422X; POWER: *; VOLTAGE_CONTINUOUS: *; VOLTAGE_MAX: *; RESISTANCE: *; MFR: Panasonic Electronic Components
SW1 = JS202011SCQN: SWITCH SLIDE DPDT 300MA 6V; MFR: C&K; Switch Function: On-On; Switch Travel: 2mm; Contact Resistance: 70mR; Electrical Life: 5000Cycles; REACH SVHC: No SVHC; Series: JS; Min Operating Temperature: -20°C; Depth: 7.5mm; Housing Material: Nylon; Voltage Rating (DC): 6V; Max Operating Temperature: 85°C; Contact Current Rating: 300mA; Package Quantity: 1; Contact Plating: Silver; Contact Material: Copper Alloy; Throw Configuration: DPDT; Current Rating: 300mA; Orientation: Vertical; Max Current Rating: 300mA; Max Voltage Rating (DC): 6V; Flammability Rating: UL94 V-2; Length: 9mm; Packaging: Tape and Reel; Mount: Surface Mount; Lead Free: Lead Free; Termination: Gull Wing; Radiation Hardening: No; MPN: JS202011SCQN
TP5-TP7 = CMP-1672-00008-1: as TP1 on sheet Power; ComponentLink1Description: Manufacturer URL; Package Quantity: 1000; DatasheetVersion: 03/2014; Packaging: Tape and Reel; ComponentLink2URL: http://www.keyelco.com/product-pdf.cfm?p=1357; ComponentLink1URL: http://www.keyelco.com/; Mount: Surface Mount; Contact Plating: Silver; PackageDescription: 1-Pin Surface Mount Device, Body 3.81 x 2.03 mm; Pins: 1; RoHSCompliant: True; Mounting Technology: Surface Mount; ComponentLink2Description: Datasheet; PackageReference: 5019; MPN: 5019
U1 = TCAN1051HGVDRQ1: IC TRANSCEIVER HALF 1/1 8SOIC; Manufacturer_Name: Texas Instruments; Datasheet Link: http://www.ti.com/lit/gpn/TCAN1051HGV-Q1; Height: 1.75mm; Mouser Part Number: 595-TCAN1051HGVDRQ1; Mouser Price/Stock: https://www.mouser.co.uk/ProductDetail/Texas-Instruments/TCAN1051HGVDRQ1?qs=dSktwyqbRaUv%252Bzz8wwNi2g%3D%3D; Arrow Part Number: TCAN1051HGVDRQ1; MPN: TCAN1051HGVDRQ1; MFR: Texas Instruments
U3 = CMP-0186-00187-1: Stand-Alone CAN Controller With SPI Interface, 20-Pin QFN, Industrial Temperature; MFR: Microchip Technology; DatasheetVersion: revF, Oct-2010; ComponentLink1URL: http://www.microchip.com/; ComponentLink3URL: http://www.microchip.com/stellent/groups/techpub_sg/documents/packagingspec/en012702.pdf; ComponentLink2Description: Datasheet; PackageDescription: 20-Lead Plastic Quad Flat, No Lead Package (ML) - 4x4x0.9 mm Body [QFN]; PackageVersion: revBB, Aug-2009; ComponentLink3Description: Package Specification; ComponentLink2URL: http://ww1.microchip.com/downloads/en/DeviceDoc/21801F.pdf; PackageReference: QFN-ML20; ComponentLink1Description: Manufacturer URL; MPN: MCP2515-I/ML
X1 = CRYSTAL_*: CRYSTAL 16.0000MHZ 10PF SMD; MANUFACTURER: TXC CORPORATION; MPN: ECS-160-10-42-CKM-TR; GateName_1: G$1; DKPN: XC2566CT-ND; MOPN: 520-160-10-42-CKMT; SHUNT_CAPACITANCE: 2 - 5 pF; SymbolName_1: CRYSTAL; LibraryName: HyTechDevices; DeviceSetName: CRYSTAL_*; Package: ECX-42; FREQUENCY: 16 MHz; LOAD_CAPACITANCE: 10pF; MFR: TXC CORPORATION

## Sheet SD_Card.SchDoc
size A; SheetNumber: 10; SheetTotal: 10
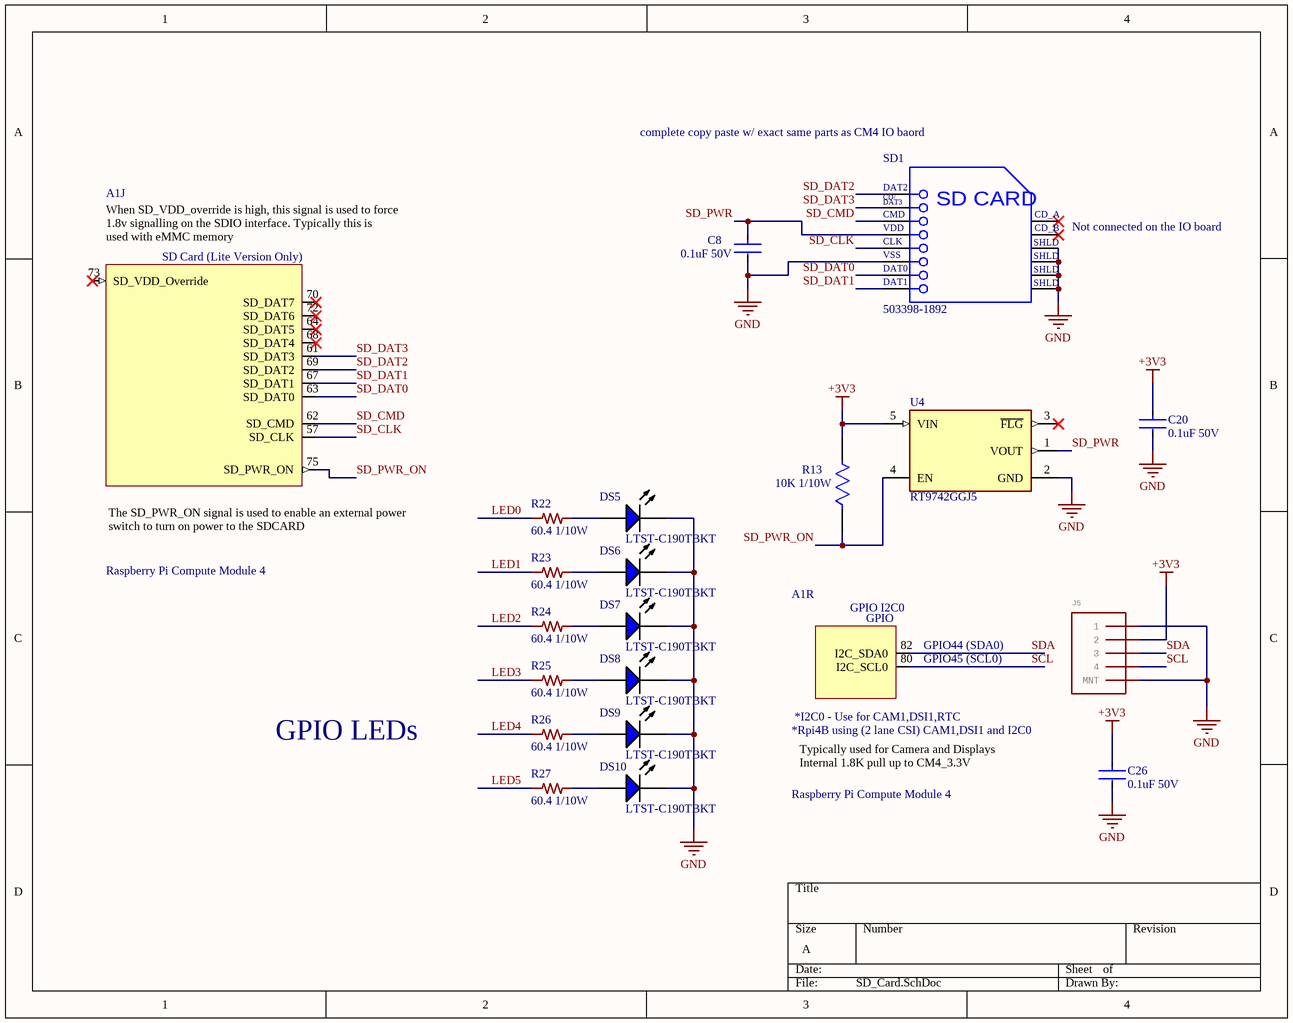
[diagram p9: SD_Card.SchDoc]

### Parts
A1  Raspberry Pi Compute Module 4  [CM4-F40C-100DS-0.4v_1.5mm_0mm]  (parts J,R of 21)  (no BOM)
C8  0.1uF 50V  [CAPACITOR_0603]
C20  0.1uF 50V  [CAPACITOR_0603]
C26  0.1uF 50V  [CAPACITOR_0603]
DS5  LTST-C190TBKT  [LTST-C190TBKT-2_V]
DS6  LTST-C190TBKT  [LTST-C190TBKT-2_V]
DS7  LTST-C190TBKT  [LTST-C190TBKT-2_V]
DS8  LTST-C190TBKT  [LTST-C190TBKT-2_V]
DS9  LTST-C190TBKT  [LTST-C190TBKT-2_V]
DS10  LTST-C190TBKT  [LTST-C190TBKT-2_V]
J5  4 Pin Connector  [JST_SM04B-SRSS-TB(LF)(SN)]  (value not drawn)
R13  10K 1/10W  [0603R]
R22  60.4 1/10W  [0603R]
R23  60.4 1/10W  [0603R]
R24  60.4 1/10W  [0603R]
R25  60.4 1/10W  [0603R]
R26  60.4 1/10W  [0603R]
R27  60.4 1/10W  [0603R]
SD1  503398-1892  [MOLX-503398-1892_V]
U4  RT9742GGJ5  [FP-RT9742GGJ5-IPC_C]

### Nets
+3V3: C20.2 C26.2 J5.2 R13.2 U4.5(VIN)
GND: C8.1 C20.1 C26.1 DS5.2(K) DS6.2(K) DS7.2(K) DS8.2(K) DS9.2(K) DS10.2(K) J5.0(MNT) J5.1 SD1.6(VSS) SD1.11(SHLD) SD1.12(SHLD) SD1.13(SHLD) SD1.14(SHLD) U4.2(GND)
LED0: R22.1
LED1: R23.1
LED2: R24.1
LED3: R25.1
LED4: R26.1
LED5: R27.1
SCL: A1.80(I2C_SCL0) J5.4
SD_CLK: A1.57(SD_CLK) SD1.5(CLK)
SD_CMD: A1.62(SD_CMD) SD1.3(CMD)
SD_DAT0: A1.63(SD_DAT0) SD1.7(DAT0)
SD_DAT1: A1.67(SD_DAT1) SD1.8(DAT1)
SD_DAT2: A1.69(SD_DAT2) SD1.1(DAT2)
SD_DAT3: A1.61(SD_DAT3) SD1.2(CD/DAT3)
SD_PWR: C8.2 SD1.4(VDD) U4.1(VOUT)
SD_PWR_ON: A1.75(SD_PWR_ON) R13.1 U4.4(EN)
SDA: A1.82(I2C_SDA0) J5.3
NetDS5_1: DS5.1(A) R22.2
NetDS6_1: DS6.1(A) R23.2
NetDS7_1: DS7.1(A) R24.2
NetDS8_1: DS8.1(A) R25.2
NetDS9_1: DS9.1(A) R26.2
NetDS10_1: DS10.1(A) R27.2

Not connected (* = marked no-connect by the designer): A1 64(SD_DAT5)* 68(SD_DAT4)* 70(SD_DAT7)* 72(SD_DAT6)* 73(SD_VDD_Override)*; SD1 9(CD_A)* 10(CD_B)*; U4 3(~{FLG})*

### Notes on the sheet
- complete copy paste w/ exact same parts as CM4 IO baord
- (near SD1) Not connected on the IO board
- GPIO LEDs
- (in symbol 503398-1892) CD/; DAT3; SD CARD
- (in symbol CM4, part J) When SD_VDD_override is high, this signal is used to force 1.8v signalling on the SDIO interface. Typically this is / used with eMMC memory; SD Card (Lite Version Only); by Amornthep Phunsin; The SD_PWR_ON signal is used to enable an external power switch to turn on power to the SDCARD
- (in symbol CM4, part R) GPIO I2C0; GPIO; GPIO44 (SDA0); GPIO45 (SCL0); *I2C0 - Use for CAM1,DSI1,RTC; *Rpi4B using (2 lane CSI) CAM1,DSI1 and I2C0; Typically used for Camera and Displays Internal 1.8K pull up to CM4_3.3V

### Library data of the parts
A1 = CM4: as A1 on sheet Pi_Boot_Control; MPN: -
C8 C20 C26 = CL10B104KB8NNWC: as C17 on sheet Power; MPN: CL10B104KB8NNWC
DS5-DS10 = LTST-C190TBKT: LED Uni-Color Blue, 76 mW, 20 mA, -20 to 80 degC, 2-Pin SMD, RoHS, Tape and Reel; MFR: Lite-On; Forward Voltage: 2.8V; Lens Style: Diffused; Luminous Intensity: 28mcd; Forward Current: 20mA; Viewing Angle: 130degrees; Nominal Vf: 3.3V; Packaging: TapeandReel; Min Operating Temperature: -20°C; Illumination Colour: Blue; Package Quantity: 3000; Pins: 2; Mounting Technology: SM; Package Reference: C190TBKT-2; Package Description: 2-Pin Surface Mount Device, Body 1.6 x 0.8 mm; RoHS Compliant: True; Datasheet URL: http://optoelectronics.liteon.com/upload/download/DS-22-99-0224/S_110_LTST-C190TBKT(0630).pdf; Datasheet Version: Rev. K, 08/2011; Manufacturer URL: http://www.us.liteon.com/; Colour: Blue; Case/Package: 0603; Max Operating Temperature: 80°C; MPN: LTST-C190TBKT
J5 = CONNECTOR-4_?_*JST_SR_R/A: CONN HEADER SMD R/A 4POS 1MM; MANUFACTURER: JST; MPN: SM04B-SRSS-TB; GateName_1: G$1; SymbolName_1: CONNECTOR_04; DeviceName: JST_SR; LibraryName: HyTechDevices; DeviceSetName: CONNECTOR-4_?_*; MFR: JST
R13 = ERJ-3EKF1002V: as R10 on sheet GPIO_CAN; MFR PN: ERJ-3EKF1002V; MPN: ERJ-3EKF1002V
R22-R27 = RMCF0603FT60R4: RES SMD 60.4 OHM 1% 1/10W 0603; MANUFACTURER: Stackpole Electronics Inc; GateName_1: G$1; SymbolName_1: RESISTOR; DeviceName: 0603; DPKN: *; MPN: RMCF0603FT60R4; POWER: *; VOLTAGE_CONTINUOUS: *; VOLTAGE_MAX: *; RESISTANCE: *; MFR: Stackpole Electronics Inc
SD1 = 503398-1892: Micro SD Connector, Pitch 1.1 mm, 8 Position, Height 1.4 mm, -25 to 85 degC, RoHS, Tape and Reel; MFR: Molex; Voltage Rating: 10VAC/DC; Current Rating: 500mA; Manufacturer URL: http://www.molex.com/; MPN: 503398-1892; Packaging: Reel; RoHS: Details; Datasheet URL: http://www.molex.com/pdm_docs/sd/5033981892_sd.pdf; Mounting Technology: SurfaceMount; Factory Pack Quantity: 2400; Datasheet Version: Rev. E, 04/2006; Series: 503398; Product Category: MemoryCardConnectors; Package Description: Micro SD Connector, Pitch 1.1 mm, 8 Position, Height 1.4 mm
U4 = CMP-79883-000001-1: IC PWR SWTCH N-CHAN 1:1 TSOT23-5; MFR: Richtek USA Inc.; Interface: On/Off; Fault Protection: Over Temperature; Max Output Current: 1A; Number of Outputs: 1; Output Configuration: High Side; On-State Resistance: 70mR; REACH SVHC: No SVHC; Number of Pins: 23; Packaging: Tape and Reel; Case/Package: SOT-23-5; RoHS Compliant: Yes; Max Operating Temperature: 85°C; Min Operating Temperature: -40°C; MPN: RT9742GGJ5

## Nets that join several sheets
+3V3: Power (R14.1), Pi_Power (6 pins), Ethernet (T1.18 T1.19), GPIO_CAN (9 pins), SD_Card (5 pins)
+5: Power (5 pins), Pi_Power (9 pins), Pi_Cellular (5 pins), GPIO_CAN (C4.1 U1.3)
+24: Power (C17.2 R16.1 TP2.1 U2.3), Ethernet (JP3.1)
GND: Power (28 pins), Pi_Power (57 pins), Pi_Cellular (9 pins), Ethernet (C19.1 T1.16 T1.Shell), GPIO_CAN (21 pins), SD_Card (17 pins)
VBATT: Power (5 pins), GPIO_CAN (C10.2 D4.1 J4.1 R11.2)
LED0: GPIO_CAN (A1.50), SD_Card (R22.1)
LED1: GPIO_CAN (A1.25), SD_Card (R23.1)
LED2: GPIO_CAN (A1.27), SD_Card (R24.1)
LED3: GPIO_CAN (A1.41), SD_Card (R25.1)
LED4: GPIO_CAN (A1.47), SD_Card (R26.1)
LED5: GPIO_CAN (A1.49), SD_Card (R27.1)